# Altium schematic sheet PMOS.SchDoc
size A4; SheetNumber: 4; SheetTotal: 4
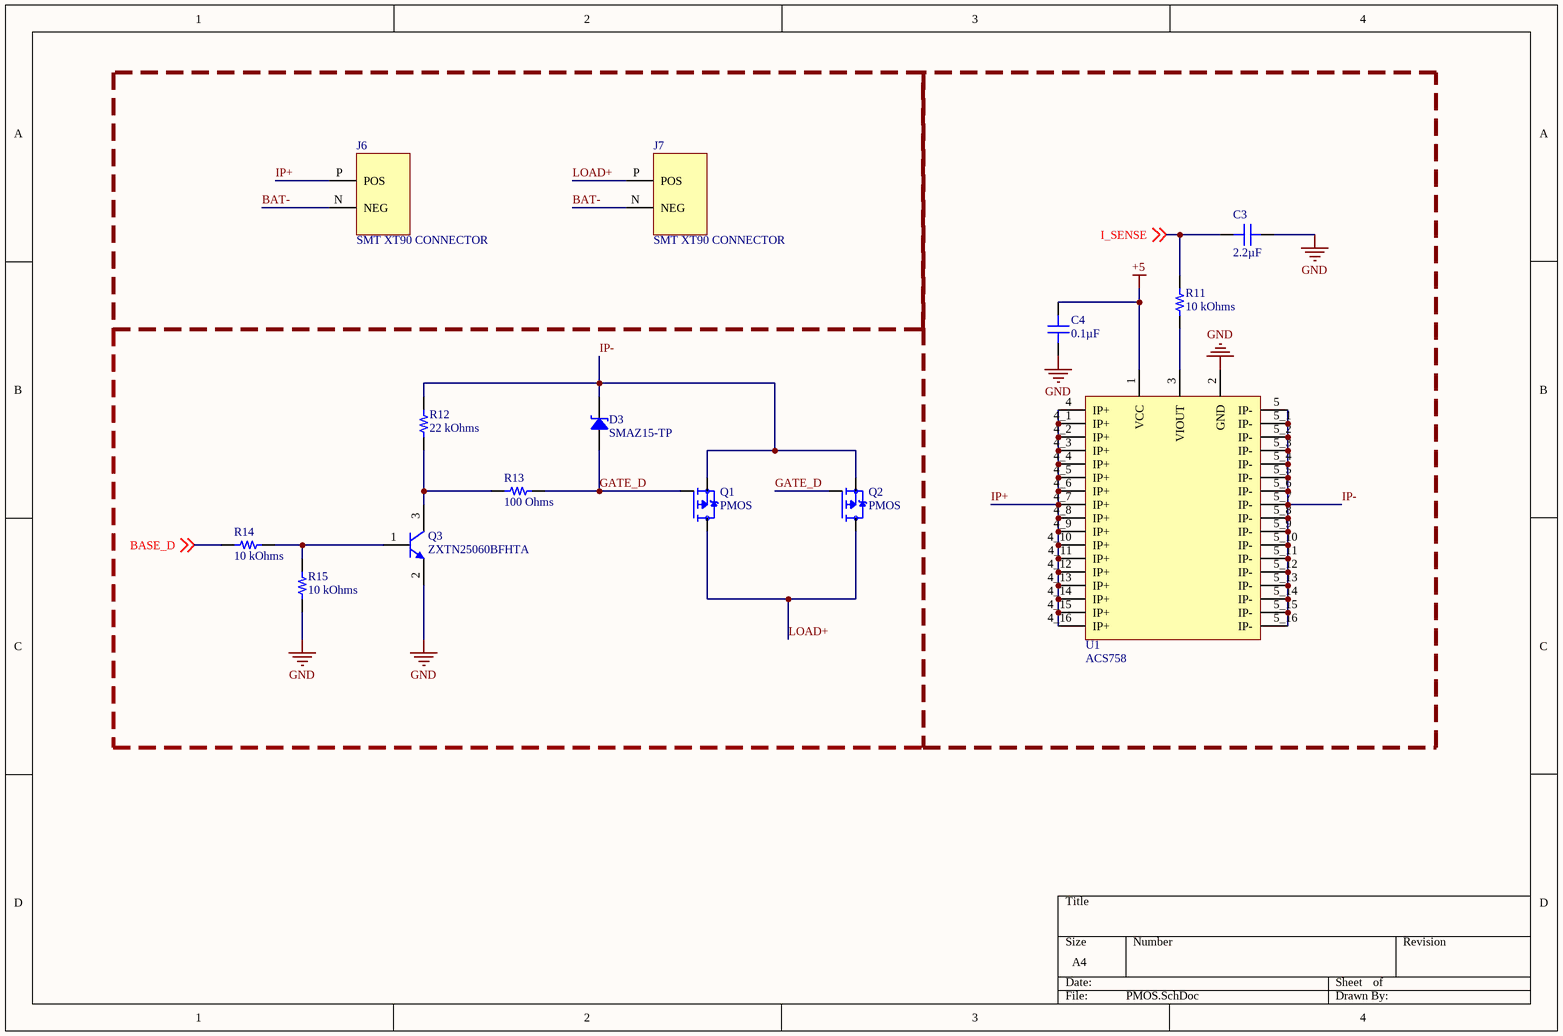
[diagram p0: PMOS.SchDoc]

## Parts
C3  2.2µF  [CAP 0603_1608]
C4  0.1µF  [CAP 0603_1608]
D3  SMAZ15-TP  [DO214AC SMA]
J6  SMT XT90 CONNECTOR  [XT90_PW-M]
J7  SMT XT90 CONNECTOR  [XT90_PW-M]
Q1  PMOS  [TO-263-3-2]
Q2  PMOS  [TO-263-3-2]
Q3  ZXTN25060BFHTA  [DIODES SOT-23-3]
R11  10 kOhms  [RES 0603_1608]
R12  22 kOhms  [YAGEO RES 1206_3216]
R13  100 Ohms  [RES 1206_3216]
R14  10 kOhms  [RES 0805_2012]
R15  10 kOhms  [RES 0805_2012]
U1  ACS758  [ACS758]

## Nets
+5: C4.2 U1.1(VCC)
GND: C3.2 C4.1 Q3.2(E) R15.1 U1.2(GND)
BASE_D: R14.2 ; off-sheet BASE_D
BAT-: J6.N(NEG) J7.N(NEG)
GATE_D: D3.1 Q1.1(G) Q2.1(G) R13.2
I_SENSE: C3.1 R11.2 ; off-sheet I_SENSE
IP+: J6.P(POS) U1.4(IP+) U1.4_1(IP+) U1.4_2(IP+) U1.4_3(IP+) U1.4_4(IP+) U1.4_5(IP+) U1.4_6(IP+) U1.4_7(IP+) U1.4_8(IP+) U1.4_9(IP+) U1.4_10(IP+) U1.4_11(IP+) U1.4_12(IP+) U1.4_13(IP+) U1.4_14(IP+) U1.4_15(IP+) U1.4_16(IP+)
IP-: D3.2 Q1.2(S) Q2.2(S) R12.2 U1.5(IP-) U1.5_1(IP-) U1.5_2(IP-) U1.5_3(IP-) U1.5_4(IP-) U1.5_5(IP-) U1.5_6(IP-) U1.5_7(IP-) U1.5_8(IP-) U1.5_9(IP-) U1.5_10(IP-) U1.5_11(IP-) U1.5_12(IP-) U1.5_13(IP-) U1.5_14(IP-) U1.5_15(IP-) U1.5_16(IP-)
LOAD+: J7.P(POS) Q1.3(D) Q2.3(D)
NetQ3_1: Q3.1(B) R14.1 R15.2
NetQ3_3: Q3.3(C) R12.1 R13.1
NetR11_1: R11.1 U1.3(VIOUT)

## Library data of the parts
C3 = 0603YD225KAT4A: CAP CER 2.2UF 16V X5R 0603; manufacturer: AVX Corporation; Tolerance: ±10%; Part Number: 0603YD225KAT4A; Capacitance: 2.2µF; Applications: General Purpose; componentlink1description: Datasheet; componentlink1url: http://datasheets.avx.com/cx5r.pdf; componentlink2description: DigiKey Link; componentlink2url: http://digikey.com/product-detail/en/avx-corporation/0603YD225KAT4A/478-12464-1-ND/9749316; Device Package: 0603 (1608 Metric); lastupdated: 2.09.2020 01:03:21; Lifecycle Status: Active; Minimum Order: 1; Mounting Type: Surface Mount, MLCC; Operating Temperature: -55°C ~ 85°C; Package / Case: 0603 (1608 Metric); packaging: TapeAndReel; partid: 10384; Part Status: Active; price: 0.19; series: -; Size / Dimension: 0.063" L x 0.032" W (1.60mm x 0.81mm); Supplier 1: DigiKey; Supplier Part Number 1: 478-12464-1-ND; Temperature Coefficient: X5R; Thickness (Max): 0.037" (0.94mm); value: 2.2µF; Voltage - Rated: 16V; JLCPCB Part Number: C23630
C4 = 06035G104ZAT2A: CAP CER 0.1UF 50V Y5V 0603; manufacturer: AVX Corporation; Temperature Coefficient: Y5V (F); Tolerance: -20%, +80%; Part Number: 06035G104ZAT2A; Capacitance: 0.1µF; Applications: General Purpose; componentlink1description: Datasheet; componentlink1url: http://datasheets.avx.com/Y5V.pdf; componentlink2description: DigiKey Link; componentlink2url: http://digikey.com/product-detail/en/avx-corporation/06035G104ZAT2A/478-3724-1-ND/1116422; Device Package: 0603 (1608 Metric); lastupdated: 2.09.2020 01:03:30; Lifecycle Status: Active; Minimum Order: 1; Mounting Type: Surface Mount, MLCC; Operating Temperature: -30°C ~ 85°C; Package / Case: 0603 (1608 Metric); packaging: TapeAndReel; partid: 5562; Part Status: Active; price: 0.01; series: -; Size / Dimension: 0.063" L x 0.032" W (1.60mm x 0.81mm); Supplier 1: DigiKey; Supplier Part Number 1: 478-3724-1-ND; Thickness (Max): 0.035" (0.90mm); value: 0.1µF; Voltage - Rated: 50V; JLCPCB Part Number: C14663
D3 = SMAZ15-TP: DIODE ZENER 15V 1W DO214AC; Manufacturer: Micro Commercial Co; Current - Reverse Leakage @ Vr: 1 µA @ 11.4 V; Impedance (Max) (Zzt): 10 Ohms; Tolerance: ±5%; Voltage - Forward (Vf) (Max) @ If: 1.2 V @ 200 mA; Part Number: SMAZ15-TP; ComponentLink1Description: Datasheet; ComponentLink1URL: https://www.mccsemi.com/pdf/Products/SMAZ5V1%20-%20SMAZ39(DO-214AC).pdf; ComponentLink2Description: DigiKey Link; ComponentLink2URL: https://www.digikey.com/en/products/detail/micro-commercial-co/SMAZ15-TP/1793256; LastUpdated: 3.06.2024 19:55:30; Lifecycle Status: Active; Minimum Order: 1; Mounting Type: Surface Mount; Operating Temperature: -65°C ~ 150°C; Package / Case: DO-214AC, SMA; Packaging: TapeAndReel; PartId: 1156; Part Status: Active; Power - Max: 1 W; Price: 0.05; Series: -; Supplier 1: DigiKey; Supplier Part Number 1: SMAZ15-TPMSCT-ND; Supplier Device Package: DO-214AC (SMAJ); Voltage - Zener (Nom) (Vz): 15 V; JLCPCB Part Number: C110524
J6 J7 = XT90_PW-M: JLCPCB Part Number: C3040689
Q3 = ZXTN25060BFHTA: TRANS NPN 60V 3.5A SOT23-3; Manufacturer: Diodes Incorporated; Current - Collector Cutoff (Max): 50nA (ICBO); DC Current Gain (hFE) (Min) @ Ic, Vce: 100 @ 10mA, 2V; Frequency - Transition: 185MHz; Power - Max: 1.25 W; Vce Saturation (Max) @ Ib, Ic: 175mV @ 350mA, 3.5A; Part Number: ZXTN25060BFHTA; ComponentLink1Description: Datasheet; ComponentLink1URL: https://www.diodes.com/assets/Datasheets/ZXTN25060BFH.pdf; ComponentLink2Description: DigiKey Link; ComponentLink2URL: https://www.digikey.com/en/products/detail/diodes-incorporated/ZXTN25060BFHTA/1043597; Current - Collector (Ic) (Max): 3.5 A; LastUpdated: 3.06.2024 20:24:10; Lifecycle Status: Active; Minimum Order: 1; Mounting Type: Surface Mount; Operating Temperature: -55°C ~ 150°C (TJ); Package / Case: TO-236-3, SC-59, SOT-23-3; Packaging: TapeAndReel; PartId: 49; Part Status: Active; Price: 0.19; Series: -; Supplier 1: DigiKey; Supplier Part Number 1: ZXTN25060BFHCT-ND; Supplier Device Package: SOT-23-3; Transistor Type: NPN; Voltage - Collector Emitter Breakdown (Max): 60 V; JLCPCB Part Number: C2145
R11 = CPF0603B10KE: RES SMD 10K OHM 0.1% 1/16W 0603; Manufacturer: TE Connectivity Passive Product; Power (Watts): 0.063W, 1/16W; Temperature Coefficient: ±25ppm/°C; Part Number: CPF0603B10KE; Value: 10 kOhms; ComponentLink1Description: Datasheet; ComponentLink1URL: https://www.te.com/commerce/DocumentDelivery/DDEController?Action=srchrtrv&DocNm=1773200&DocType=DS&DocLang=English; ComponentLink2Description: DigiKey Link; ComponentLink2URL: https://www.digikey.com/en/products/detail/te-connectivity-passive-product/CPF0603B10KE/2389826; Composition: Thin Film; Device Package: 0603 (1608 Metric); Height - Seated (Max): 0.022" (0.55mm); LastUpdated: 9.02.2024 20:43:37; Lifecycle Status: Active; Minimum Order: 1; Number of Terminations: 2; Operating Temperature: -55°C ~ 155°C; Package / Case: 0603 (1608 Metric); Packaging: TapeAndReel; PartId: 4872; Part Status: Active; Price: 0.09; Resistance: 10 kOhms; Series: CPF, Neohm; Size / Dimension: 0.061" L x 0.031" W (1.55mm x 0.80mm); Supplier 1: DigiKey; Supplier Part Number 1: A119886CT-ND; Supplier Device Package: 0603; Tolerance: ±0.1%; JLCPCB Part Number: C25804
R12 = RT1206BRD0722KL: RES SMD 22K OHM 0.1% 1/4W 1206; Manufacturer: Yageo; Power (Watts): 0.25W, 1/4W; Temperature Coefficient: ±25ppm/°C; Part Number: RT1206BRD0722KL; ComponentLink1Description: Datasheet; ComponentLink1URL: https://www.yageo.com/upload/media/product/productsearch/datasheet/rchip/PYu-RT_1-to-0.01_RoHS_L_11.pdf; ComponentLink2Description: DigiKey Link; ComponentLink2URL: https://www.digikey.com/en/products/detail/yageo/RT1206BRD0722KL/1079646; Composition: Thin Film; Device Package: 1206 (3216 Metric); Height - Seated (Max): 0.026" (0.65mm); LastUpdated: 25.07.2024 09:21:39; Lifecycle Status: Active; Minimum Order: 1; Number of Terminations: 2; Operating Temperature: -55°C ~ 155°C; Package / Case: 1206 (3216 Metric); Packaging: TapeAndReel; PartId: 26867; Part Status: Active; Price: 0.09; Resistance: 22 kOhms; Series: RT; Size / Dimension: 0.122" L x 0.063" W (3.10mm x 1.60mm); Supplier 1: DigiKey; Supplier Part Number 1: YAG2027CT-ND; Supplier Device Package: 1206; Tolerance: ±0.1%; Value: 22 kOhms; JLCPCB Part Number: C18003
R13 = RNCP1206FTD100R: RES 100 OHM 1% 1/2W 1206; Manufacturer: Stackpole Electronics Inc; Power (Watts): 0.5W, 1/2W; Temperature Coefficient: ±100ppm/°C; Part Number: RNCP1206FTD100R; ComponentLink1Description: Datasheet; ComponentLink1URL: https://www.seielect.com/catalog/sei-rncp.pdf; ComponentLink2Description: DigiKey Link; ComponentLink2URL: https://www.digikey.com/en/products/detail/stackpole-electronics-inc/RNCP1206FTD100R/2240316; Composition: Thin Film; Device Package: 1206 (3216 Metric); Features: Anti-Sulfur; Height - Seated (Max): 0.025" (0.65mm); LastUpdated: 9.02.2024 20:54:45; Lifecycle Status: Active; Minimum Order: 1; Number of Terminations: 2; Operating Temperature: -55°C ~ 155°C; Package / Case: 1206 (3216 Metric); Packaging: TapeAndReel; PartId: 26969; Part Status: Active; Price: 0.01; Resistance: 100 Ohms; Series: RNCP; Size / Dimension: 0.122" L x 0.059" W (3.10mm x 1.50mm); Supplier 1: DigiKey; Supplier Part Number 1: RNCP1206FTD100RCT-ND; Supplier Device Package: 1206; Tolerance: ±1%; Value: 100 Ohms; JLCPCB Part Number: C17901
R14 R15 = Y162410K0000T9R: RES SMD 10K OHM 0.01% 1/5W 0805; Manufacturer: Vishay Foil Resistors (Division of Vishay Precision Group); Power (Watts): 0.2W, 1/5W; Temperature Coefficient: ±0.2ppm/°C; Part Number: Y162410K0000T9R; Value: 10 kOhms; ComponentLink1Description: Datasheet; ComponentLink1URL: http://www.vishaypg.com/docs/63060/VSMP.pdf; ComponentLink2Description: DigiKey Link; ComponentLink2URL: https://www.digikey.com/en/products/detail/vishay-foil-resistors-division-of-vishay-precision-group/Y162410K0000T9R/1888101; Composition: Metal Foil; Device Package: 0805 (2012 Metric); Features: Moisture Resistant, Non-Inductive; Height - Seated (Max): 0.025" (0.64mm); LastUpdated: 8.02.2024 21:00:56; Lifecycle Status: Active; Minimum Order: 1; Number of Terminations: 2; Operating Temperature: -55°C ~ 150°C; Package / Case: 0805 (2012 Metric); Packaging: TapeAndReel; PartId: 48767; Part Status: Active; Price: 8.64; Resistance: 10 kOhms; Series: VSMP; Size / Dimension: 0.080" L x 0.050" W (2.03mm x 1.27mm); Supplier 1: DigiKey; Supplier Part Number 1: Y1624-10KCT-ND; Supplier Device Package: 0805; Tolerance: ±0.01%; JLCPCB Part Number: C17414
U1 = ACS758: Current Sensor 150A 1 Channel Hall Effect, Open Loop Unidirectional 5-CB Formed Leads, PFF
Q1 Q2 = PMOS: JLCPCB Part Number: C2909634